# EAGLE schematic ms_subsystem (EAGLE 9.6.1)
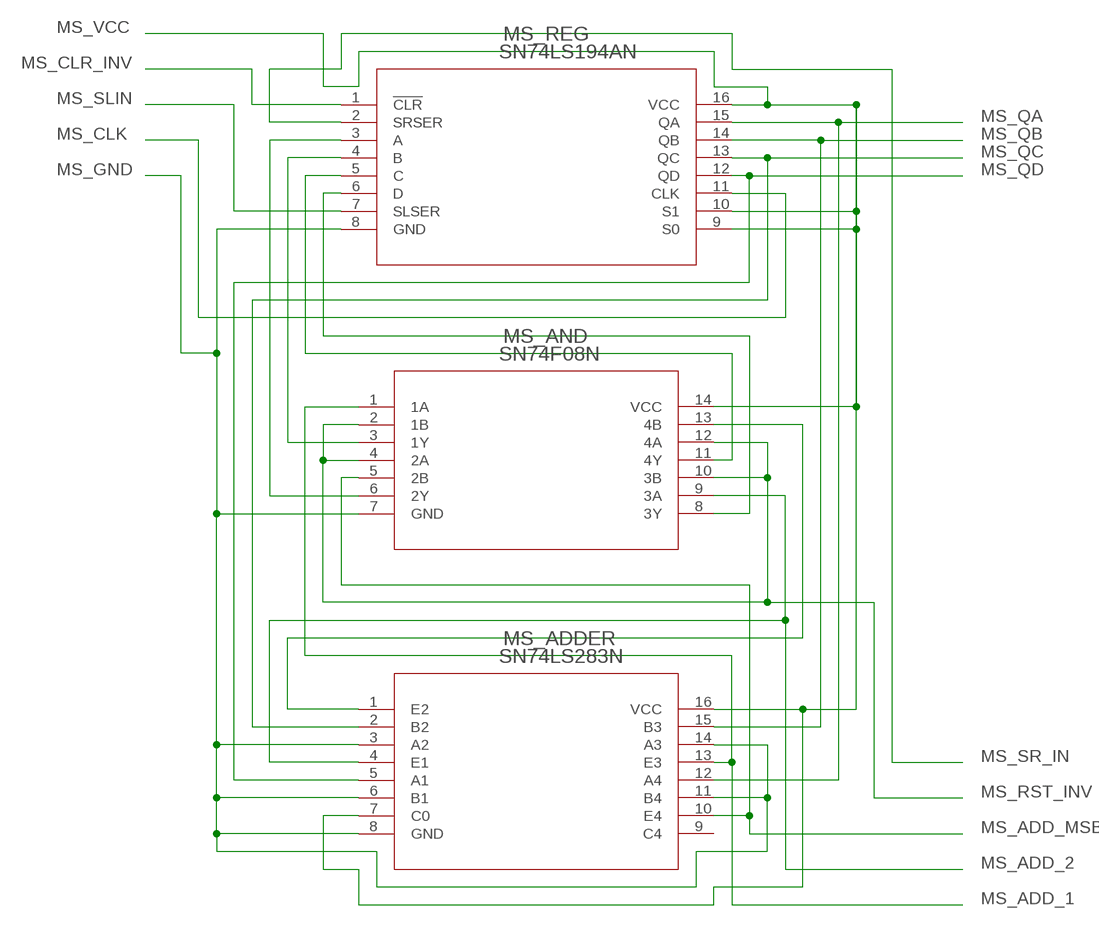
[diagram p0: schematic, sheet 1]

## Parts
MS_ADDER  SN74LS283N  [N16]
MS_AND  SN74F08N  [N14]
MS_REG  SN74LS194AN  [N16]

## Nets
MS_ADD_1: MS_ADDER.13(E3) MS_AND.1(1A)
MS_ADD_2: MS_ADDER.4(E1) MS_AND.9(3A)
MS_ADD_MSB: MS_ADDER.10(E4) MS_AND.5(2B)
MS_CLK: MS_REG.11(CLK)
MS_CLR_INV: MS_REG.1(!CLR)
MS_GND: MS_ADDER.3(A2) MS_ADDER.6(B1) MS_ADDER.8(GND) MS_ADDER.11(B4) MS_ADDER.14(A3) MS_AND.7(GND) MS_REG.8(GND)
MS_QA: MS_ADDER.12(A4) MS_REG.15(QA)
MS_QB: MS_ADDER.15(B3) MS_REG.14(QB)
MS_QC: MS_ADDER.2(B2) MS_REG.13(QC)
MS_QD: MS_ADDER.5(A1) MS_REG.12(QD)
MS_RST_INV: MS_AND.2(1B) MS_AND.4(2A) MS_AND.10(3B) MS_AND.12(4A)
MS_SLIN: MS_REG.7(SLSER)
MS_SR_IN: MS_REG.2(SRSER)
MS_VCC: MS_ADDER.7(C0) MS_ADDER.16(VCC) MS_AND.14(VCC) MS_REG.9(S0) MS_REG.10(S1) MS_REG.16(VCC)
N$1: MS_AND.6(2Y) MS_REG.3(A)
N$2: MS_AND.3(1Y) MS_REG.4(B)
N$3: MS_AND.11(4Y) MS_REG.5(C)
N$4: MS_AND.8(3Y) MS_REG.6(D)
N$6: MS_ADDER.1(E2) MS_AND.13(4B)
Unconnected: MS_ADDER.9(C4)

## Library data of the parts
MS_ADDER = sn74ls283n:SN74LS283N: 4-Bit Full Adder w/ Fast Carry; DATASHEET_URL: http://www.ti.com/lit/gpn/SN74LS283; DESCRIPTION: 4-Bit Binary Full Adders With Fast Carry; FAMILY_NAME: ADDER; GENERIC_PART_NUMBER: SN74LS283; INDUSTRY_STD_PKG_TYPE: PDIP; MANUFACTURER: Texas Instruments; PACKAGE_DESIGNATOR: N; PIN_COUNT: 16
MS_AND = sn74f08n:SN74F08N: Quad 2-In Positive AND; DATASHEET_URL: http://www.ti.com/lit/gpn/SN74F08; DESCRIPTION: Quadruple 2-Input Positive-AND Gate; FAMILY_NAME: AND GATE; GENERIC_PART_NUMBER: SN74F08; INDUSTRY_STD_PKG_TYPE: PDIP; MANUFACTURER: Texas Instruments; PACKAGE_DESIGNATOR: N; PIN_COUNT: 14
MS_REG = sn74ls194an:SN74LS194AN: 4-Bit BiDir. Universal Shift Register; DATASHEET_URL: http://www.ti.com/lit/gpn/SN74LS194A; DESCRIPTION: Bidirectional universal shift registers; FAMILY_NAME: SHIFT REGISTER; GENERIC_PART_NUMBER: SN74LS194A; INDUSTRY_STD_PKG_TYPE: PDIP; MANUFACTURER: Texas Instruments; PACKAGE_DESIGNATOR: N; PIN_COUNT: 16